# Altium schematic sheet Regulators.SchDoc
size A3; SheetNumber: 3; SheetTotal: 4; SPICEModelCacheRCVYWZKJ: <root> / <DocumentId>RCVYWZKJ</DocumentId> / <CacheFrame Number="0"> / <Model Name="0805_885012007012_22pf" Kind="CKT"> / <Text>******* / .subckt 0805_885012007012_22pF 1 2 / Rser 1 3 0.353164620745 / Lser 2 4 4.83956508E-10 / C1 3 4 0.000000000022 / Rpar 3 4 10000000000 / .ends 0805_885012007012_22pF</Text> / </Model> / </CacheFrame> / </root>
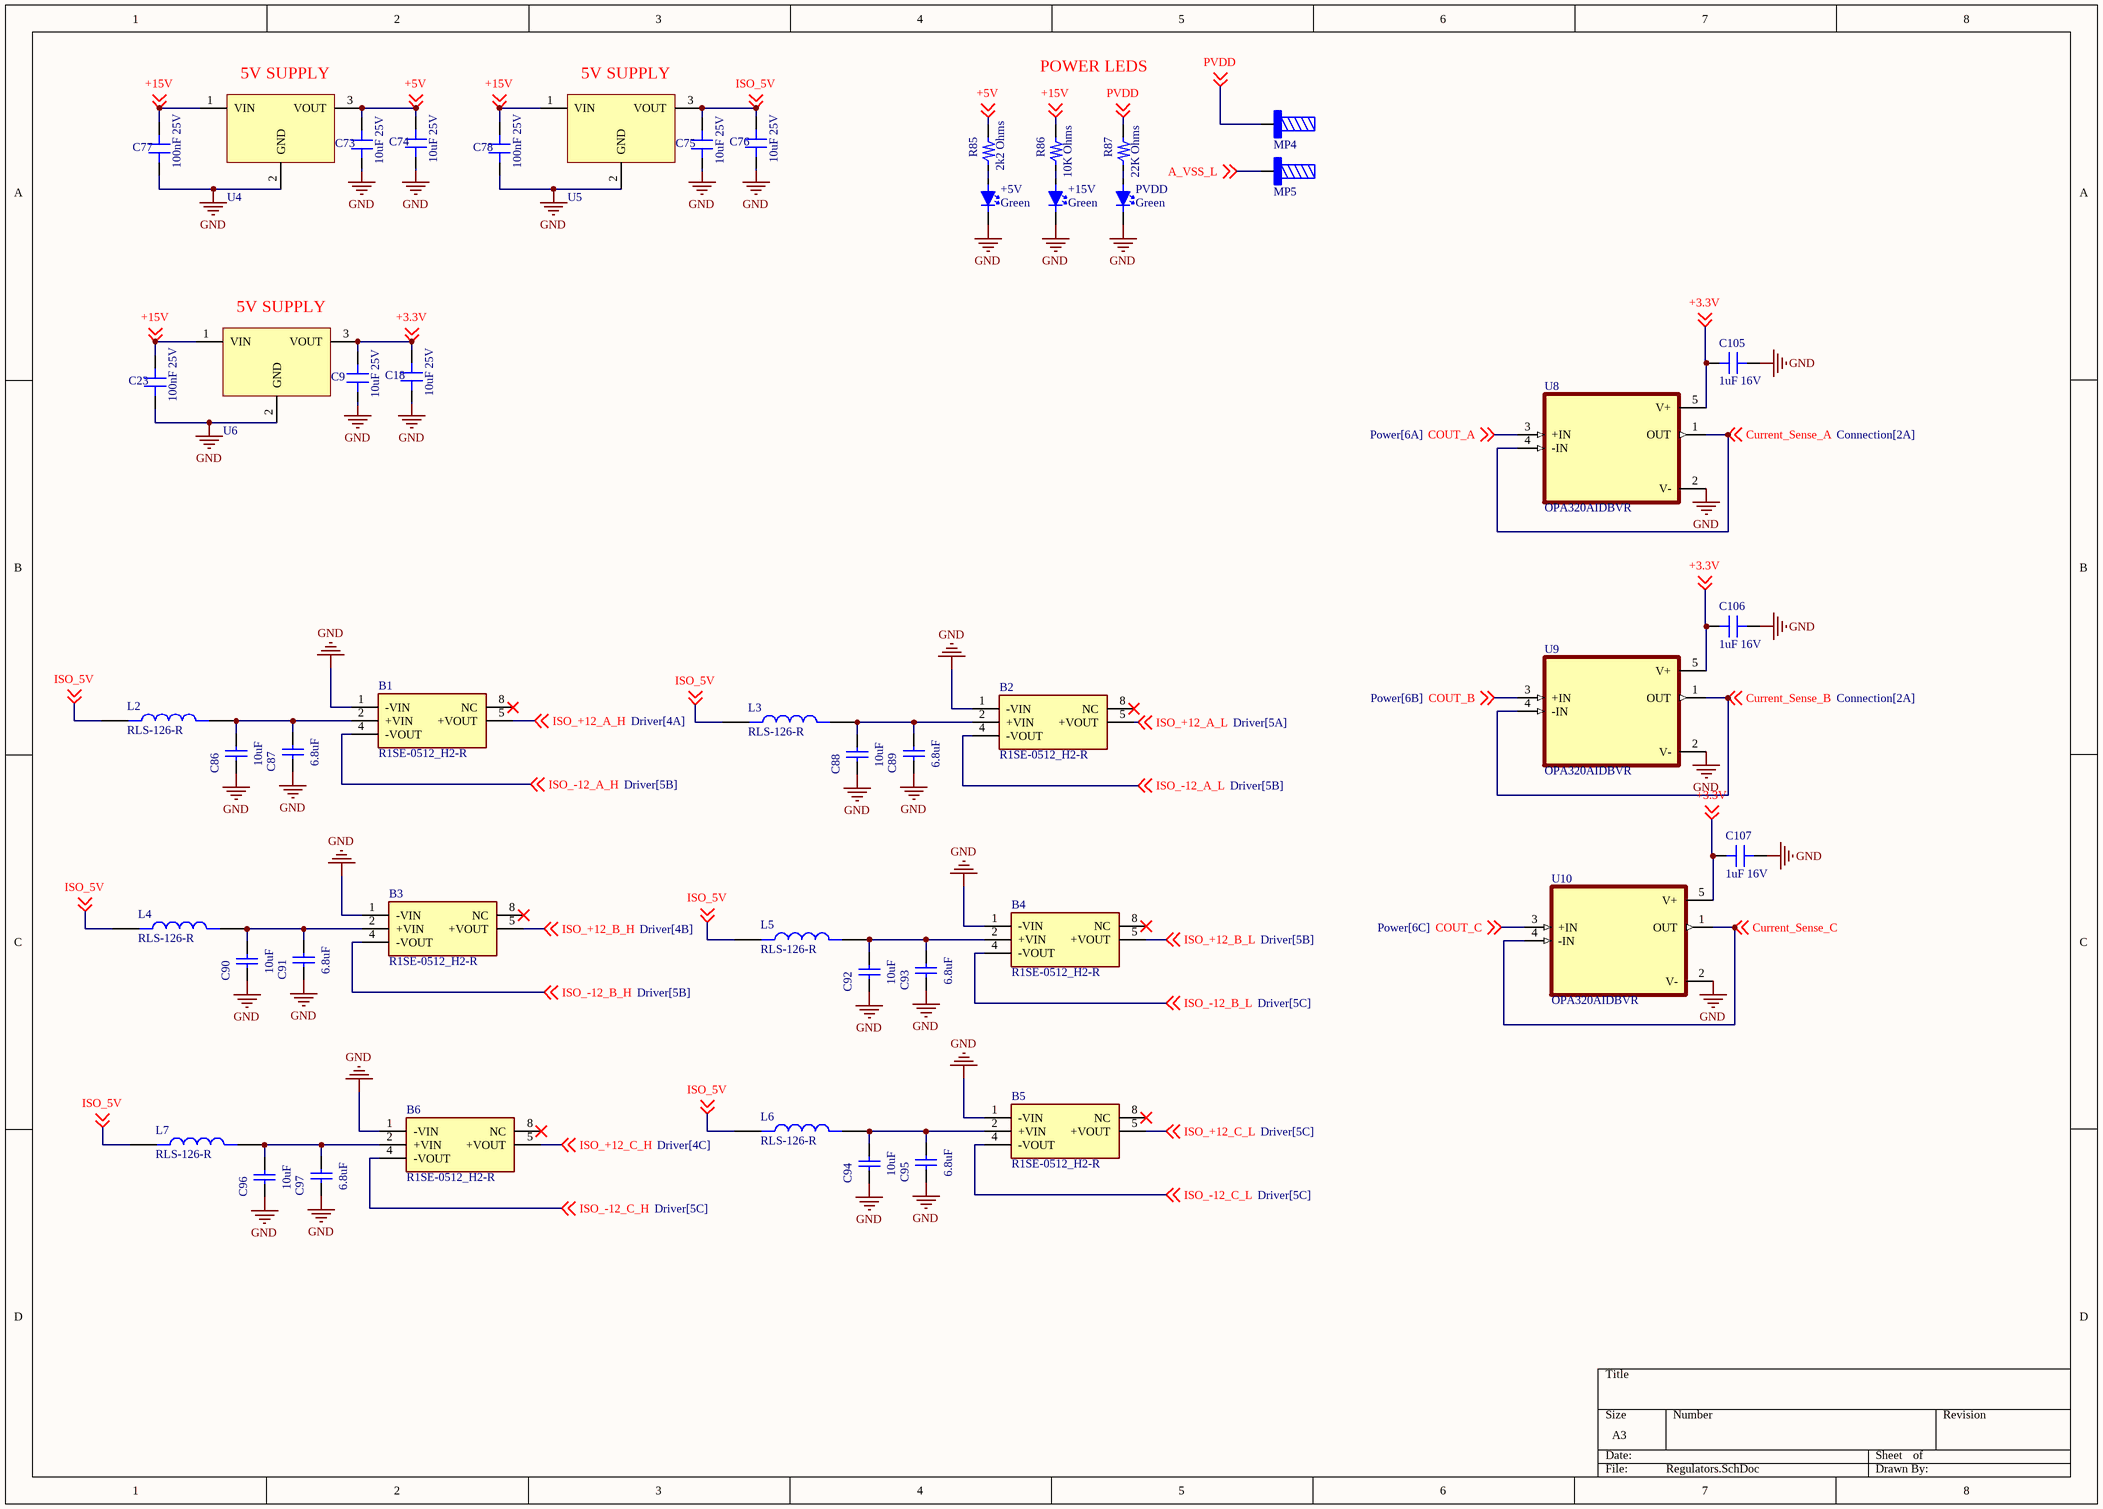
[diagram p0: Regulators.SchDoc]

## Parts
+5V  Green  [0805LED]
+15V  Green  [0805LED]
B1  R1SE-0512_H2-R  [R1SE3305H2R]
B2  R1SE-0512_H2-R  [R1SE3305H2R]
B3  R1SE-0512_H2-R  [R1SE3305H2R]
B4  R1SE-0512_H2-R  [R1SE3305H2R]
B5  R1SE-0512_H2-R  [R1SE3305H2R]
B6  R1SE-0512_H2-R  [R1SE3305H2R]
C9  10uF 25V  [0603_CAP]
C18  10uF 25V  [0603_CAP]
C23  100nF 25V  [0603_CAP]
C73  10uF 25V  [0603_CAP]
C74  10uF 25V  [0603_CAP]
C75  10uF 25V  [0603_CAP]
C76  10uF 25V  [0603_CAP]
C77  100nF 25V  [0603_CAP]
C78  100nF 25V  [0603_CAP]
C86  10uF  [WCAP-CSGP_0805_L2W1.25H0.6_Reflow]
C87  6.8uF  [WCAP-CSGP_0805_L2W1.25H0.6_Reflow]
C88  10uF  [WCAP-CSGP_0805_L2W1.25H0.6_Reflow]
C89  6.8uF  [WCAP-CSGP_0805_L2W1.25H0.6_Reflow]
C90  10uF  [WCAP-CSGP_0805_L2W1.25H0.6_Reflow]
C91  6.8uF  [WCAP-CSGP_0805_L2W1.25H0.6_Reflow]
C92  10uF  [WCAP-CSGP_0805_L2W1.25H0.6_Reflow]
C93  6.8uF  [WCAP-CSGP_0805_L2W1.25H0.6_Reflow]
C94  10uF  [WCAP-CSGP_0805_L2W1.25H0.6_Reflow]
C95  6.8uF  [WCAP-CSGP_0805_L2W1.25H0.6_Reflow]
C96  10uF  [WCAP-CSGP_0805_L2W1.25H0.6_Reflow]
C97  6.8uF  [WCAP-CSGP_0805_L2W1.25H0.6_Reflow]
C105  1uF 16V  [0603_CAP]
C106  1uF 16V  [0603_CAP]
C107  1uF 16V  [0603_CAP]
L2  RLS-126-R  [IND_RLS-126-R]
L3  RLS-126-R  [IND_RLS-126-R]
L4  RLS-126-R  [IND_RLS-126-R]
L5  RLS-126-R  [IND_RLS-126-R]
L6  RLS-126-R  [IND_RLS-126-R]
L7  RLS-126-R  [IND_RLS-126-R]
MP4  M6 x 10mm  [7461098_chemical surface]  (value not drawn)
MP5  M6 x 10mm  [7461098_chemical surface]  (value not drawn)
PVDD  Green  [0805LED]
R85  2k2 Ohms  [0805_RES]
R86  10K Ohms  [0805_RES]
R87  22K Ohms  [0805_RES]
U4  8-28Vin, 5Vout, 1Aout  [WPME-FDSM_SIP-3_L11.6W8.5H10.5]  (value not drawn)
U5  8-28Vin, 5Vout, 1Aout  [WPME-FDSM_SIP-3_L11.6W8.5H10.5]  (value not drawn)
U6  8-28Vin, 5Vout, 1Aout  [WPME-FDSM_SIP-3_L11.6W8.5H10.5]  (value not drawn)
U8  OPA320AIDBVR  [SOT95P280X145-5N]
U9  OPA320AIDBVR  [SOT95P280X145-5N]
U10  OPA320AIDBVR  [SOT95P280X145-5N]

## Nets
GND: +5V.2(Cathode(-)) +15V.2(Cathode(-)) B1.1(-VIN) B2.1(-VIN) B3.1(-VIN) B4.1(-VIN) B5.1(-VIN) B6.1(-VIN) C9.1 C18.1 C23.1 C73.1 C74.1 C75.1 C76.1 C77.1 C78.1 C86.1 C87.1 C88.1 C89.1 C90.1 C91.1 C92.1 C93.1 C94.1 C95.1 C96.1 C97.1 C105.2 C106.2 C107.2 PVDD.2(Cathode(-)) U4.2(GND) U5.2(GND) U6.2(GND) U8.2(V-) U9.2(V-) U10.2(V-)
+3.3V: C9.2 C18.2 C105.1 C106.1 C107.1 U6.3(VOUT) U8.5(V+) U9.5(V+) U10.5(V+) ; off-sheet +3.3V
+5V: C73.2 C74.2 R85.1 U4.3(VOUT) ; off-sheet +5V
+15V: C23.2 C77.2 C78.2 R86.1 U4.1(VIN) U5.1(VIN) U6.1(VIN) ; off-sheet +15V
A_VSS_L: MP5.1 ; off-sheet A_VSS_L
COUT_A: U8.3(+IN) ; off-sheet COUT_A
COUT_B: U9.3(+IN) ; off-sheet COUT_B
COUT_C: U10.3(+IN) ; off-sheet COUT_C
Current_Sense_A: U8.1(OUT) U8.4(-IN) ; off-sheet Current_Sense_A
Current_Sense_B: U9.1(OUT) U9.4(-IN) ; off-sheet Current_Sense_B
Current_Sense_C: U10.1(OUT) U10.4(-IN) ; off-sheet Current_Sense_C
ISO_5V: C75.2 C76.2 L2.1 L3.1 L4.1 L5.1 L6.1 L7.1 U5.3(VOUT) ; off-sheet ISO_5V
ISO_+12_A_H: B1.5(+VOUT) ; off-sheet ISO_+12_A_H
ISO_+12_A_L: B2.5(+VOUT) ; off-sheet ISO_+12_A_L
ISO_+12_B_H: B3.5(+VOUT) ; off-sheet ISO_+12_B_H
ISO_+12_B_L: B4.5(+VOUT) ; off-sheet ISO_+12_B_L
ISO_+12_C_H: B6.5(+VOUT) ; off-sheet ISO_+12_C_H
ISO_+12_C_L: B5.5(+VOUT) ; off-sheet ISO_+12_C_L
ISO_-12_A_H: B1.4(-VOUT) ; off-sheet ISO_-12_A_H
ISO_-12_A_L: B2.4(-VOUT) ; off-sheet ISO_-12_A_L
ISO_-12_B_H: B3.4(-VOUT) ; off-sheet ISO_-12_B_H
ISO_-12_B_L: B4.4(-VOUT) ; off-sheet ISO_-12_B_L
ISO_-12_C_H: B6.4(-VOUT) ; off-sheet ISO_-12_C_H
ISO_-12_C_L: B5.4(-VOUT) ; off-sheet ISO_-12_C_L
PVDD: MP4.1 R87.1 ; off-sheet PVDD
Net+5V_1: +5V.1(Anode(+)) R85.2
Net+15V_1: +15V.1(Anode(+)) R86.2
NetB1_2: B1.2(+VIN) C86.2 C87.2 L2.2
NetB2_2: B2.2(+VIN) C88.2 C89.2 L3.2
NetB3_2: B3.2(+VIN) C90.2 C91.2 L4.2
NetB4_2: B4.2(+VIN) C92.2 C93.2 L5.2
NetB5_2: B5.2(+VIN) C94.2 C95.2 L6.2
NetB6_2: B6.2(+VIN) C96.2 C97.2 L7.2
NetPVDD_1: PVDD.1(Anode(+)) R87.2

Not connected (* = marked no-connect by the designer): B1 8(NC)*; B2 8(NC)*; B3 8(NC)*; B4 8(NC)*; B5 8(NC)*; B6 8(NC)*

## Notes on the sheet
- (near U4) 5V SUPPLY
- (near U5) 5V SUPPLY
- POWER LEDS
- (near U6) 5V SUPPLY

## Library data of the parts
+5V +15V PVDD = LED: 0805
B1-B6 = R1SE-0512_H2-R: RECOM POWER - R1SE-0512/H2-R - DC-DC CONVERTER, 12V, 0.084A, SMD; Geometry.Height: 7.5mm; Manufacturer_Name: RECOM Power; Manufacturer_Part_Number: R1SE-0512/H2-R; Mouser Part Number: 919-R1SE-0512/H2-R; Mouser Price/Stock: https://www.mouser.co.uk/ProductDetail/RECOM-Power/R1SE-0512-H2-R?qs=2sV1BwmkawRQ2FXa7NBFcA%3D%3D; Arrow Part Number: R1SE-0512/H2-R; Arrow Price/Stock: https://www.arrow.com/en/products/r1se-0512h2-r/recom-power?region=nac; Datasheet Link: https://componentsearchengine.com/Datasheets/1/R1SE-0512_H2-R.pdf
C9 C18 C23 C73-C78 = CAP_0603: CL10B105KO8NNNC - MLCC (1608) 0603 1uF 16VDC ±10% X7R; Value: 1uF 16V
C86-C97 = 885012007012: WCAP-CSGP Multilayer Ceramic Chip Capacitor, General Purpose, size 0805, NP0, 22pF, 16V; Manufacturer: Wurth Elektronik; Case/Size Code: 0805; Capacitance Tolerance: +/-5%; Insulation Resistance: 10GΩ; Q Factor: 840; Technical Reference: NP00805220J016DFCT10000; Manufacturer Part Number: 885012007012; Category: Multilayer Ceramic Chip Capacitors; Match Code: WCAP-CSGP; ComponentLink1Description: Website Link; ComponentLink1URL: https://www.we-online.com/redexpert/article/885012007012?ad; ComponentLink2Description: Datasheet Link; ComponentLink2URL: https://www.we-online.com/redexpert/spec/885012007012?ad; Mount: Surface Mount; Min Operating Temperature: -55°C; Max Operating Temperature: 125°C; Packaging: Tape and Reel; Length: 2mm; Width: 1.25mm; Height: 0.6mm; Capacitance: 22pF; Ceramic Type: NP0; Rated Voltage (DC): 16V
C105-C107 = CAP_0603: CL10B105KO8NNNC - MLCC (1608) 0603 1uF 16VDC ±10% X7R; Value: 1uF 16V
L2-L7 = RLS-126-R: Line Inductors for RECOM Power Supply; SnapEDA_Link: https://www.snapeda.com/parts/RLS-126-R/Recom+Power/view-part/?ref=snap; Package: None; Value: *; MF: Recom Power; MP: RLS-126-R; Check_prices: https://www.snapeda.com/parts/RLS-126-R/Recom+Power/view-part/?ref=eda
MP4 MP5 = 7461098: WP-SHFU REDCUBE PRESS-FIT with external thread, L13W13H15.5mm, M6 x 10mm, 250A; Manufacturer: Wurth Elektronik; Surface: Tin; ComponentLink1Description: Website Link; ComponentLink1URL: https://www.we-online.com/redexpert/article/7461098?ad; ComponentLink2Description: Datasheet Link; ComponentLink2URL: https://www.we-online.com/redexpert/spec/7461098?ad; Manufacturer Part Number: 7461098; Category: REDCUBE PRESS-FIT; Match Code: WP-SHFU; Mount: Press Fit; Operating Temperature Max: 150°C; Operating Temperature Min: -55°C; Packaging: Bulk; Length: 13mm; Width: 13mm; Height: 15.5mm; Material: Brass; Number of Pins: 25; Rated Current: 250A; Thread Length: 10mm; Thread Size: M6
R85-R87 = RES_0805: 0805; Power: 1/8 W
  R85: Value: 2k2 Ohms
  R86: Value: 10K Ohms
  R87: Value: 22K Ohms
U4-U6 = 173010578: WPME-FDSM Fixed Step Down Regulator Module, THT, SIP-3, 8-28Vin, 5Vout, 1Aout; Manufacturer: Wurth Elektronik; Input Voltage Min: 8V; Input Voltage Max: 28V; Output Current: 1A; Output Voltage: 5V; Manufacturer Part Number: 173010578; Category: Step Down Converter; Match Code: WPME-FDSM; ComponentLink1Description: Website Link; ComponentLink1URL: https://www.we-online.com/redexpert/article/173010578?ad; ComponentLink2Description: Datasheet Link; ComponentLink2URL: https://www.we-online.com/redexpert/spec/173010578?ad; Mount: Through Hole; Operating Temperature Max: 85°C; Operating Temperature Min: -40°C; Packaging: Tube; Case/Size Code: SIP-3; Length: 11.6mm; Width: 8.5mm; Height: 10.5mm
U8-U10 = OPA320AIDBVR: Precision, zero-crossover, 20-MHz, 0.9-pA Ib, RRIO, CMOS operational amplifier; MF: Texas Instruments; Availability: In Stock; SnapEDA_Link: https://www.snapeda.com/parts/OPA320AIDBVR/Texas+Instruments/view-part/?ref=snap; Price: None; Check_prices: https://www.snapeda.com/parts/OPA320AIDBVR/Texas+Instruments/view-part/?ref=eda; Package: SOT-23-5 Texas Instruments; MP: OPA320AIDBVR; Value: *; Purchase-URL: https://pricing.snapeda.com/search/part/OPA320AIDBVR/?ref=eda